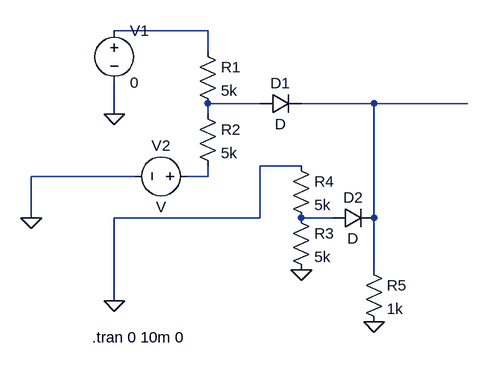
[diagram p0: schematic Draft1.asc]
Draft1.asc, the LTspice schematic file:
Version 4
SHEET 1 880 680
WIRE 80 64 -64 64
WIRE 80 96 80 64
WIRE 160 176 80 176
WIRE 336 176 224 176
WIRE 480 176 336 176
WIRE -64 192 -64 144
WIRE 80 192 80 176
WIRE 224 272 160 272
WIRE -32 288 -192 288
WIRE 80 288 80 272
WIRE 80 288 48 288
WIRE -192 352 -192 288
WIRE 160 352 160 272
WIRE 160 352 -64 352
WIRE 272 352 224 352
WIRE 336 352 336 176
WIRE 336 432 336 352
WIRE -64 480 -64 352
FLAG -64 480 0
FLAG -64 192 0
FLAG 224 432 0
FLAG 336 512 0
FLAG -192 352 0
SYMBOL res 64 80 R0
SYMATTR InstName R1
SYMATTR Value 5k
SYMBOL res 64 176 R0
SYMATTR InstName R2
SYMATTR Value 5k
SYMBOL diode 160 192 R270
WINDOW 0 32 32 VTop 2
WINDOW 3 0 32 VBottom 2
SYMATTR InstName D1
SYMBOL diode 272 368 R270
WINDOW 0 32 32 VTop 2
WINDOW 3 0 32 VBottom 2
SYMATTR InstName D2
SYMBOL res 208 336 R0
SYMATTR InstName R3
SYMATTR Value 5k
SYMBOL res 208 256 R0
SYMATTR InstName R4
SYMATTR Value 5k
SYMBOL voltage -64 48 R0
WINDOW 123 0 0 Left 0
WINDOW 39 0 0 Left 0
SYMATTR InstName V1
SYMATTR Value 0
SYMBOL res 320 416 R0
SYMATTR InstName R5
SYMATTR Value 1k
SYMBOL voltage 64 288 R90
WINDOW 0 -32 56 VBottom 2
WINDOW 3 32 56 VTop 2
SYMATTR InstName V2
TEXT -98 536 Left 2 !.tran 0 10m 0

The netlist it stands for:
* Draft1.asc
R1 N001 N002 5k
R2 N002 N004 5k
D1 N002 N003 D
D2 N005 N003 D
R3 N005 0 5k
R4 0 N005 5k
V1 N001 0 0
R5 N003 0 1k
V2 N004 0 V
.model D D
.lib standard.dio
.tran 0 10m 0
.backanno
.end